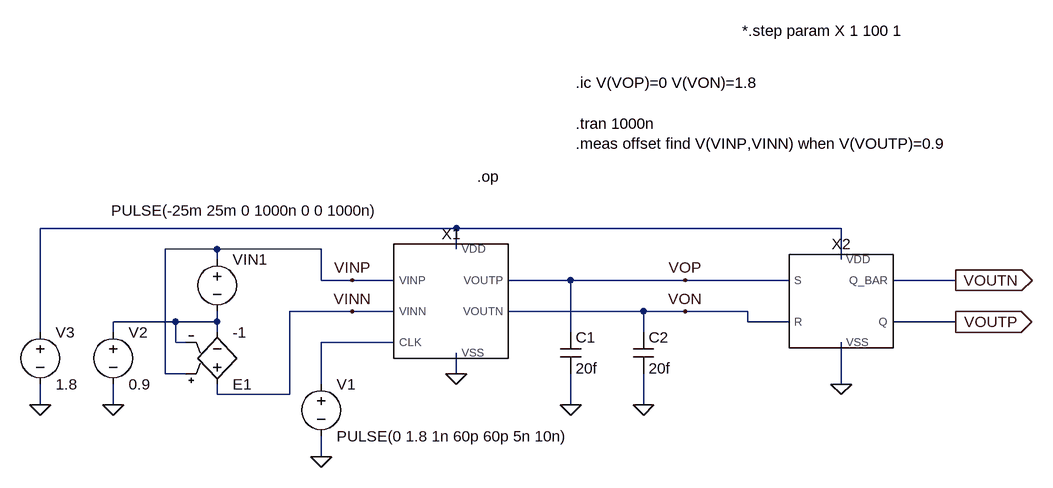
[diagram p0: schematic tb_offset.asc]
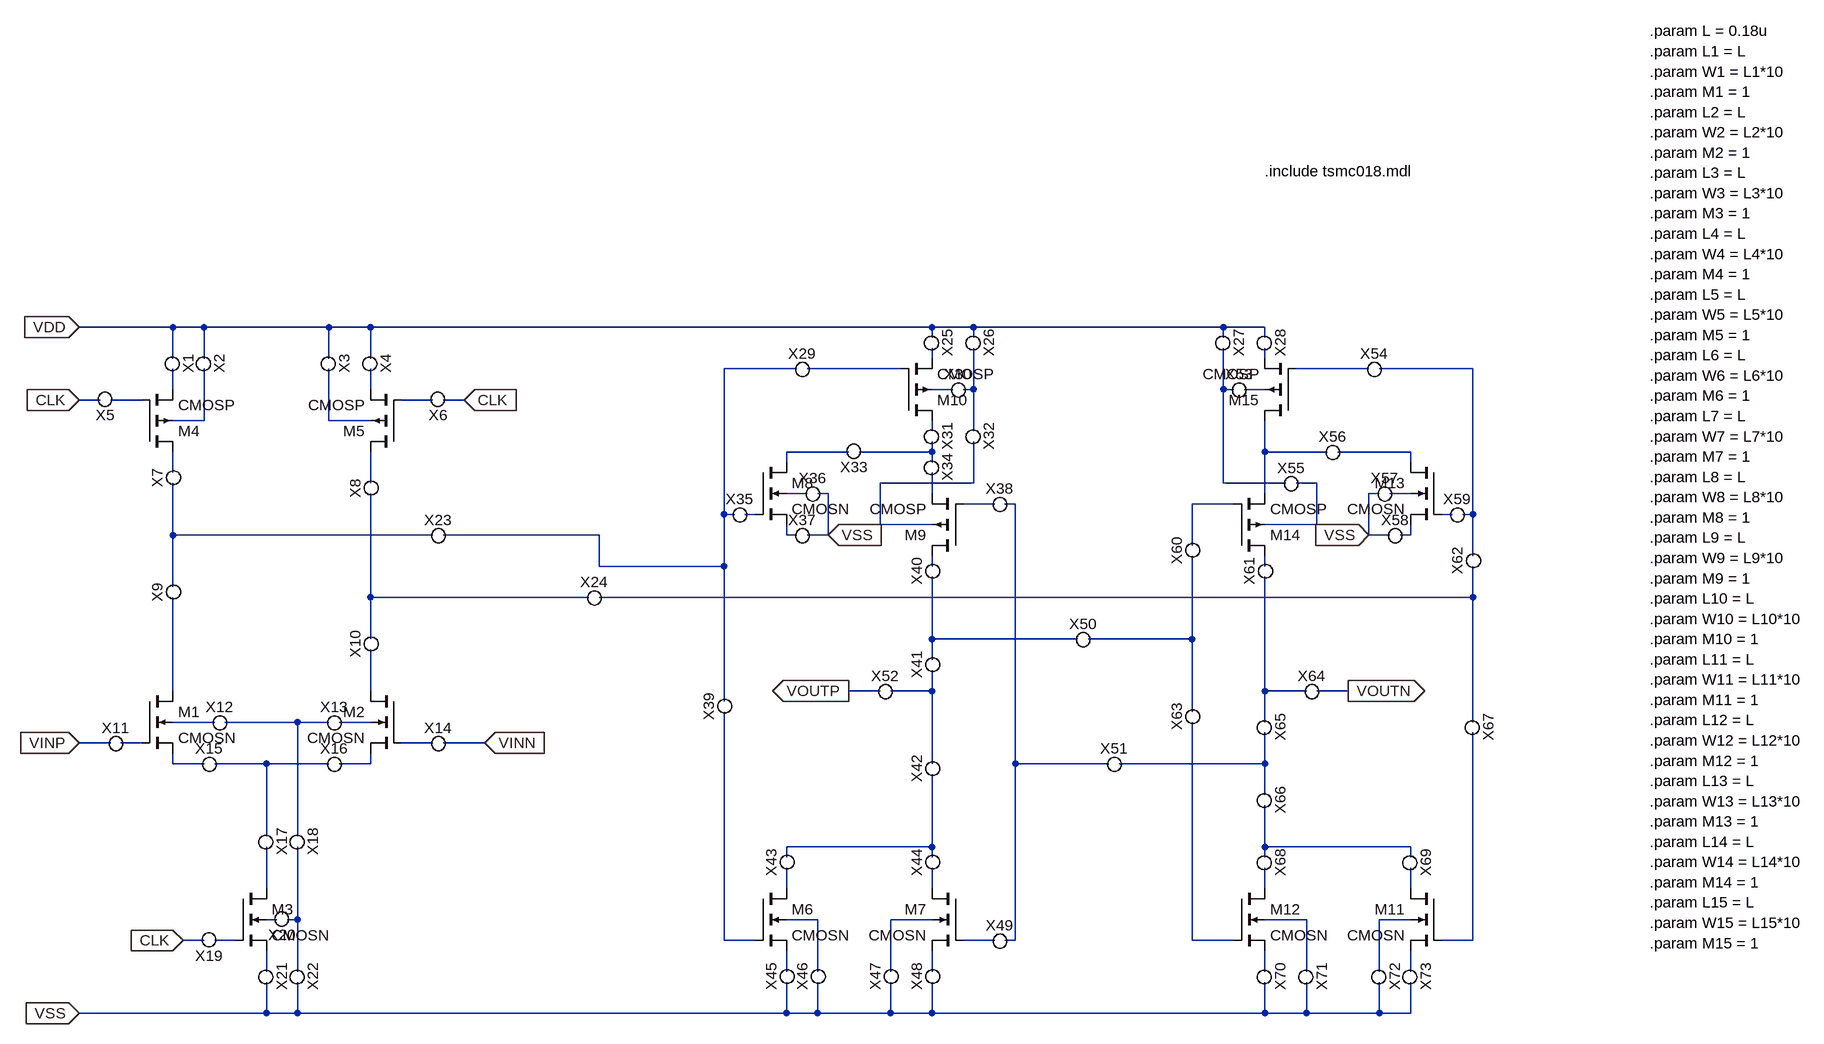
[diagram p1: sub-circuit my_comparator.asc]
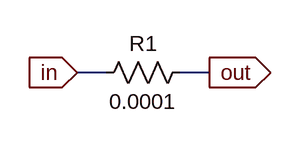
[diagram p2: sub-circuit para_register.asc]
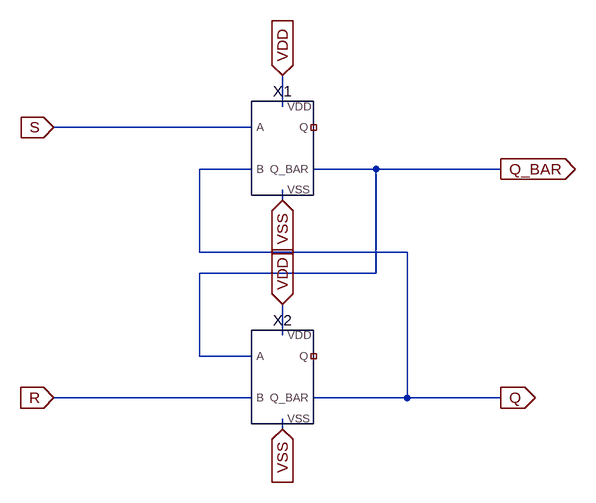
[diagram p3: sub-circuit my_sr_flipflop.asc]
tb_offset.asc, the LTspice schematic file:
Version 4
SHEET 1 904 680
WIRE -16 112 -656 112
WIRE 576 112 -16 112
WIRE -384 144 -464 144
WIRE -224 144 -384 144
WIRE -16 144 -16 112
WIRE -384 160 -384 144
WIRE 576 160 576 112
WIRE -224 192 -224 144
WIRE -176 192 -224 192
WIRE -112 192 -176 192
WIRE 160 192 64 192
WIRE 336 192 160 192
WIRE 496 192 336 192
WIRE 752 192 656 192
WIRE -176 240 -272 240
WIRE -112 240 -176 240
WIRE 272 240 64 240
WIRE 336 240 272 240
WIRE 432 240 336 240
WIRE -448 256 -544 256
WIRE -384 256 -384 240
WIRE -384 256 -448 256
WIRE 432 256 432 240
WIRE 496 256 432 256
WIRE 752 256 656 256
WIRE -656 272 -656 112
WIRE -544 272 -544 256
WIRE -384 272 -384 256
WIRE 160 272 160 192
WIRE 272 272 272 240
WIRE -448 288 -448 256
WIRE -432 288 -448 288
WIRE -112 288 -224 288
WIRE -464 336 -464 144
WIRE -432 336 -464 336
WIRE -16 336 -16 304
WIRE -224 352 -224 288
WIRE 576 352 576 288
WIRE -384 368 -384 352
WIRE -272 368 -272 240
WIRE -272 368 -384 368
WIRE -656 384 -656 352
WIRE -544 384 -544 352
WIRE 160 384 160 336
WIRE 272 384 272 336
WIRE -224 464 -224 432
FLAG -656 384 0
FLAG -544 384 0
FLAG -224 464 0
FLAG 160 384 0
FLAG 272 384 0
FLAG -16 336 0
FLAG -176 192 VINP
FLAG -176 240 VINN
FLAG 336 192 VOP
FLAG 336 240 VON
FLAG 576 352 0
FLAG 752 192 VOUTN
IOPIN 752 192 Out
FLAG 752 256 VOUTP
IOPIN 752 256 Out
SYMBOL voltage -224 336 R0
WINDOW 123 0 0 Left 0
WINDOW 39 0 0 Left 0
SYMATTR InstName V1
SYMATTR Value PULSE(0 1.8 1n 60p 60p 5n 10n)
SYMBOL voltage -384 144 R0
WINDOW 123 0 0 Left 0
WINDOW 39 0 0 Left 0
WINDOW 3 -163 -59 Left 2
SYMATTR Value PULSE(-25m 25m 0 1000n 0 0 1000n)
SYMATTR InstName VIN1
SYMBOL voltage -544 256 R0
WINDOW 123 0 0 Left 0
WINDOW 39 0 0 Left 0
SYMATTR InstName V2
SYMATTR Value 0.9
SYMBOL voltage -656 256 R0
WINDOW 123 0 0 Left 0
WINDOW 39 0 0 Left 0
SYMATTR InstName V3
SYMATTR Value 1.8
SYMBOL e -384 368 M180
SYMATTR InstName E1
SYMATTR Value -1
SYMBOL cap 144 272 R0
SYMATTR InstName C1
SYMATTR Value 20f
SYMBOL cap 256 272 R0
SYMATTR InstName C2
SYMATTR Value 20f
SYMBOL my_comparator -32 224 R0
SYMATTR InstName X1
SYMBOL my_sr_flipflop 576 224 R0
SYMATTR InstName X2
TEXT 16 32 Left 2 !.op
TEXT 168 -112 Left 2 !.ic V(VOP)=0 V(VON)=1.8\n \n.tran 1000n\n.meas offset find V(VINP,VINN) when V(VOUTP)=0.9
TEXT 424 -192 Left 2 !*.step param X 1 100 1

my_comparator.asc, the sub-circuit schematic file:
Version 4
SHEET 1 2728 992
WIRE 80 -400 -64 -400
WIRE 128 -400 80 -400
WIRE 320 -400 128 -400
WIRE 384 -400 320 -400
WIRE 1248 -400 384 -400
WIRE 1312 -400 1248 -400
WIRE 1696 -400 1312 -400
WIRE 1760 -400 1696 -400
WIRE 1248 -384 1248 -400
WIRE 1312 -384 1312 -400
WIRE 1696 -384 1696 -400
WIRE 1760 -384 1760 -400
WIRE 80 -352 80 -400
WIRE 128 -352 128 -400
WIRE 320 -352 320 -400
WIRE 384 -352 384 -400
WIRE 1248 -352 1248 -368
WIRE 1760 -352 1760 -368
WIRE 1040 -336 928 -336
WIRE 1200 -336 1056 -336
WIRE 1920 -336 1808 -336
WIRE 2080 -336 1936 -336
WIRE 80 -304 80 -336
WIRE 384 -304 384 -336
WIRE 1280 -304 1248 -304
WIRE 1312 -304 1312 -368
WIRE 1312 -304 1296 -304
WIRE 1696 -304 1696 -368
WIRE 1712 -304 1696 -304
WIRE 1760 -304 1728 -304
WIRE -32 -288 -64 -288
WIRE 32 -288 -16 -288
WIRE 480 -288 432 -288
WIRE 528 -288 496 -288
WIRE 128 -256 128 -336
WIRE 128 -256 80 -256
WIRE 320 -256 320 -336
WIRE 384 -256 320 -256
WIRE 1248 -240 1248 -256
WIRE 1312 -240 1312 -304
WIRE 1120 -208 1024 -208
WIRE 1248 -208 1248 -224
WIRE 1248 -208 1136 -208
WIRE 1760 -208 1760 -256
WIRE 1856 -208 1760 -208
WIRE 1984 -208 1872 -208
WIRE 1024 -192 1024 -208
WIRE 1248 -192 1248 -208
WIRE 1984 -192 1984 -208
WIRE 80 -176 80 -208
WIRE 384 -160 384 -208
WIRE 1312 -160 1312 -224
WIRE 1312 -160 1168 -160
WIRE 1696 -160 1696 -304
WIRE 1792 -160 1696 -160
WIRE 1840 -160 1808 -160
WIRE 1056 -144 1024 -144
WIRE 1088 -144 1072 -144
WIRE 1248 -144 1248 -176
WIRE 1760 -144 1760 -208
WIRE 1936 -144 1920 -144
WIRE 1984 -144 1952 -144
WIRE 1344 -128 1296 -128
WIRE 1376 -128 1360 -128
WIRE 1712 -128 1648 -128
WIRE 928 -112 928 -336
WIRE 944 -112 928 -112
WIRE 976 -112 960 -112
WIRE 2048 -112 2032 -112
WIRE 2080 -112 2080 -336
WIRE 2080 -112 2064 -112
WIRE 1168 -96 1168 -160
WIRE 1248 -96 1168 -96
WIRE 1840 -96 1840 -160
WIRE 1840 -96 1760 -96
WIRE 80 -80 80 -160
WIRE 480 -80 80 -80
WIRE 736 -80 496 -80
WIRE 1024 -80 1024 -96
WIRE 1040 -80 1024 -80
WIRE 1088 -80 1088 -144
WIRE 1088 -80 1056 -80
WIRE 1920 -80 1920 -144
WIRE 1952 -80 1920 -80
WIRE 1984 -80 1984 -96
WIRE 1984 -80 1968 -80
WIRE 1648 -64 1648 -128
WIRE 2080 -48 2080 -112
WIRE 736 -32 736 -80
WIRE 928 -32 928 -112
WIRE 928 -32 736 -32
WIRE 1248 -32 1248 -48
WIRE 1760 -32 1760 -48
WIRE 80 0 80 -80
WIRE 384 16 384 -144
WIRE 720 16 384 16
WIRE 2080 16 2080 -32
WIRE 2080 16 736 16
WIRE 384 80 384 16
WIRE 1248 80 1248 -16
WIRE 1472 80 1248 80
WIRE 1648 80 1648 -48
WIRE 1648 80 1488 80
WIRE 1248 112 1248 80
WIRE 80 160 80 16
WIRE 384 160 384 96
WIRE 1168 160 1120 160
WIRE 1248 160 1248 128
WIRE 1248 160 1184 160
WIRE 1760 160 1760 -16
WIRE 1824 160 1760 160
WIRE 1888 160 1840 160
WIRE 928 176 928 -32
WIRE 1648 192 1648 80
WIRE 144 208 80 208
WIRE 272 208 160 208
WIRE 320 208 272 208
WIRE 384 208 336 208
WIRE 1760 208 1760 160
WIRE 2080 208 2080 16
WIRE -16 240 -64 240
WIRE 32 240 0 240
WIRE 480 240 432 240
WIRE 560 240 496 240
WIRE 80 272 80 256
WIRE 128 272 80 272
WIRE 224 272 144 272
WIRE 320 272 224 272
WIRE 384 272 384 256
WIRE 384 272 336 272
WIRE 1248 272 1248 160
WIRE 1376 272 1376 -128
WIRE 1520 272 1376 272
WIRE 1760 272 1760 224
WIRE 1760 272 1536 272
WIRE 1760 320 1760 272
WIRE 224 384 224 272
WIRE 272 384 272 208
WIRE 1248 400 1248 288
WIRE 1248 400 1024 400
WIRE 1760 400 1760 336
WIRE 1984 400 1760 400
WIRE 1024 416 1024 400
WIRE 1248 416 1248 400
WIRE 1760 416 1760 400
WIRE 1984 416 1984 400
WIRE 224 464 224 400
WIRE 1024 464 1024 432
WIRE 1248 464 1248 432
WIRE 1760 464 1760 432
WIRE 1984 464 1984 432
WIRE 240 512 224 512
WIRE 272 512 272 400
WIRE 272 512 256 512
WIRE 1072 512 1024 512
WIRE 1248 512 1184 512
WIRE 1824 512 1760 512
WIRE 1984 512 1936 512
WIRE 128 544 96 544
WIRE 176 544 144 544
WIRE 928 544 928 192
WIRE 976 544 928 544
WIRE 1344 544 1296 544
WIRE 1376 544 1376 272
WIRE 1376 544 1360 544
WIRE 1648 544 1648 208
WIRE 1712 544 1648 544
WIRE 2080 544 2080 224
WIRE 2080 544 2032 544
WIRE 224 592 224 560
WIRE 272 592 272 512
WIRE 1024 592 1024 560
WIRE 1072 592 1072 512
WIRE 1184 592 1184 512
WIRE 1248 592 1248 560
WIRE 1760 592 1760 560
WIRE 1824 592 1824 512
WIRE 1936 592 1936 512
WIRE 1984 592 1984 560
WIRE 224 656 224 608
WIRE 224 656 -64 656
WIRE 272 656 272 608
WIRE 272 656 224 656
WIRE 1024 656 1024 608
WIRE 1024 656 272 656
WIRE 1072 656 1072 608
WIRE 1072 656 1024 656
WIRE 1184 656 1184 608
WIRE 1184 656 1072 656
WIRE 1248 656 1248 608
WIRE 1248 656 1184 656
WIRE 1760 656 1760 608
WIRE 1760 656 1248 656
WIRE 1824 656 1824 608
WIRE 1824 656 1760 656
WIRE 1936 656 1936 608
WIRE 1936 656 1824 656
WIRE 1984 656 1984 608
WIRE 1984 656 1936 656
FLAG -64 -400 VDD
IOPIN -64 -400 In
FLAG -64 -288 CLK
IOPIN -64 -288 In
FLAG -64 240 VINP
IOPIN -64 240 In
FLAG -64 656 VSS
IOPIN -64 656 In
FLAG 560 240 VINN
IOPIN 560 240 In
FLAG 96 544 CLK
IOPIN 96 544 In
FLAG 528 -288 CLK
IOPIN 528 -288 In
FLAG 1088 -80 VSS
IOPIN 1088 -80 In
FLAG 1120 160 VOUTP
IOPIN 1120 160 Out
FLAG 1920 -80 VSS
IOPIN 1920 -80 In
FLAG 1888 160 VOUTN
IOPIN 1888 160 Out
SYMBOL nmos4 432 160 M0
SYMATTR InstName M2
SYMATTR Value CMOSN
SYMATTR Value2 l={L2} w={W2} m={M2}
SYMBOL nmos4 176 464 R0
SYMATTR InstName M3
SYMATTR Value CMOSN
SYMATTR Value2 l={L3} w={W3} m={M3}
SYMBOL pmos4 32 -208 M180
SYMATTR InstName M4
SYMATTR Value CMOSP
SYMATTR Value2 l={L4} w={W4} m={M4}
SYMBOL pmos4 432 -208 R180
SYMATTR InstName M5
SYMATTR Value CMOSP
SYMATTR Value2 l={L5} w={W5} m={M5}
SYMBOL nmos4 32 160 R0
SYMATTR InstName M1
SYMATTR Value CMOSN
SYMATTR Value2 l={L1} w={W1} m={M1}
SYMBOL nmos4 976 464 R0
SYMATTR InstName M6
SYMATTR Value CMOSN
SYMATTR Value2 l={L6} w={W6} m={M6}
SYMBOL nmos4 1296 464 M0
SYMATTR InstName M7
SYMATTR Value CMOSN
SYMATTR Value2 l={L7} w={W7} m={M7}
SYMBOL nmos4 976 -192 R0
SYMATTR InstName M8
SYMATTR Value CMOSN
SYMATTR Value2 l={L8} w={W8} m={M8}
SYMBOL pmos4 1296 -48 R180
SYMATTR InstName M9
SYMATTR Value CMOSP
SYMATTR Value2 l={L9} w={W9} m={M9}
SYMBOL pmos4 1200 -256 M180
SYMATTR InstName M10
SYMATTR Value CMOSP
SYMATTR Value2 l={L10} w={W10} m={M10}
SYMBOL nmos4 2032 464 M0
SYMATTR InstName M11
SYMATTR Value CMOSN
SYMATTR Value2 l={L11} w={W11} m={M11}
SYMBOL nmos4 1712 464 R0
SYMATTR InstName M12
SYMATTR Value CMOSN
SYMATTR Value2 l={L12} w={W12} m={M12}
SYMBOL nmos4 2032 -192 M0
SYMATTR InstName M13
SYMATTR Value CMOSN
SYMATTR Value2 l={L13} w={W13} m={M13}
SYMBOL pmos4 1712 -48 M180
SYMATTR InstName M14
SYMATTR Value CMOSP
SYMATTR Value2 l={L14} w={W14} m={M14}
SYMBOL pmos4 1808 -256 R180
SYMATTR InstName M15
SYMATTR Value CMOSP
SYMATTR Value2 l={L15} w={W15} m={M15}
SYMBOL para_register 64 -352 R90
SYMATTR InstName X1
SYMBOL para_register 112 -352 R90
SYMATTR InstName X2
SYMBOL para_register 304 -352 R90
SYMATTR InstName X3
SYMBOL para_register 368 -352 R90
SYMATTR InstName X4
SYMBOL para_register -16 -304 R180
SYMATTR InstName X5
SYMBOL para_register 496 -304 R180
SYMATTR InstName X6
SYMBOL para_register 96 -160 R270
SYMATTR InstName X7
SYMBOL para_register 400 -144 R270
SYMATTR InstName X8
SYMBOL para_register 96 16 R270
SYMATTR InstName X9
SYMBOL para_register 400 96 R270
SYMATTR InstName X10
SYMBOL para_register -16 256 R0
SYMATTR InstName X11
SYMBOL para_register 144 224 R0
SYMATTR InstName X12
SYMBOL para_register 320 224 R0
SYMATTR InstName X13
SYMBOL para_register 480 256 R0
SYMATTR InstName X14
SYMBOL para_register 128 288 R0
SYMATTR InstName X15
SYMBOL para_register 320 288 R0
SYMATTR InstName X16
SYMBOL para_register 208 384 R90
SYMATTR InstName X17
SYMBOL para_register 256 384 R90
SYMATTR InstName X18
SYMBOL para_register 144 528 R180
SYMATTR InstName X19
SYMBOL para_register 256 496 R180
SYMATTR InstName X20
SYMBOL para_register 208 592 R90
SYMATTR InstName X21
SYMBOL para_register 256 592 R90
SYMATTR InstName X22
SYMBOL para_register 480 -64 R0
SYMATTR InstName X23
SYMBOL para_register 720 32 R0
SYMATTR InstName X24
SYMBOL para_register 1232 -384 R90
SYMATTR InstName X25
SYMBOL para_register 1296 -384 R90
SYMATTR InstName X26
SYMBOL para_register 1680 -384 R90
SYMATTR InstName X27
SYMBOL para_register 1744 -384 R90
SYMATTR InstName X28
SYMBOL para_register 1040 -320 R0
SYMATTR InstName X29
SYMBOL para_register 1280 -288 R0
SYMATTR InstName X30
SYMBOL para_register 1232 -240 R90
SYMATTR InstName X31
SYMBOL para_register 1296 -240 R90
SYMATTR InstName X32
SYMBOL para_register 1136 -224 R180
SYMATTR InstName X33
SYMBOL para_register 1232 -192 R90
SYMATTR InstName X34
SYMBOL para_register 944 -96 R0
SYMATTR InstName X35
SYMBOL para_register 1056 -128 R0
SYMATTR InstName X36
SYMBOL para_register 1040 -64 R0
SYMATTR InstName X37
SYMBOL para_register 1344 -112 R0
SYMATTR InstName X38
SYMBOL para_register 944 192 R270
SYMATTR InstName X39
SYMBOL para_register 1264 -16 R270
SYMATTR InstName X40
SYMBOL para_register 1264 128 R270
SYMATTR InstName X41
SYMBOL para_register 1264 288 R270
SYMATTR InstName X42
SYMBOL para_register 1040 432 R270
SYMATTR InstName X43
SYMBOL para_register 1264 432 R270
SYMATTR InstName X44
SYMBOL para_register 1040 608 R270
SYMATTR InstName X45
SYMBOL para_register 1088 608 R270
SYMATTR InstName X46
SYMBOL para_register 1200 608 R270
SYMATTR InstName X47
SYMBOL para_register 1264 608 R270
SYMATTR InstName X48
SYMBOL para_register 1344 560 R0
SYMATTR InstName X49
SYMBOL para_register 1472 96 R0
SYMATTR InstName X50
SYMBOL para_register 1520 288 R0
SYMATTR InstName X51
SYMBOL para_register 1168 176 R0
SYMATTR InstName X52
SYMBOL para_register 1712 -288 R0
SYMATTR InstName X53
SYMBOL para_register 1920 -320 R0
SYMATTR InstName X54
SYMBOL para_register 1792 -144 R0
SYMATTR InstName X55
SYMBOL para_register 1856 -192 R0
SYMATTR InstName X56
SYMBOL para_register 1936 -128 R0
SYMATTR InstName X57
SYMBOL para_register 1952 -64 R0
SYMATTR InstName X58
SYMBOL para_register 2048 -96 R0
SYMATTR InstName X59
SYMBOL para_register 1664 -48 R270
SYMATTR InstName X60
SYMBOL para_register 1776 -16 R270
SYMATTR InstName X61
SYMBOL para_register 2096 -32 R270
SYMATTR InstName X62
SYMBOL para_register 1664 208 R270
SYMATTR InstName X63
SYMBOL para_register 1824 176 R0
SYMATTR InstName X64
SYMBOL para_register 1744 208 R90
SYMATTR InstName X65
SYMBOL para_register 1744 320 R90
SYMATTR InstName X66
SYMBOL para_register 2064 208 R90
SYMATTR InstName X67
SYMBOL para_register 1744 416 R90
SYMATTR InstName X68
SYMBOL para_register 1968 416 R90
SYMATTR InstName X69
SYMBOL para_register 1744 592 R90
SYMATTR InstName X70
SYMBOL para_register 1808 592 R90
SYMATTR InstName X71
SYMBOL para_register 1920 592 R90
SYMATTR InstName X72
SYMBOL para_register 1968 592 R90
SYMATTR InstName X73
TEXT 2352 -856 Left 2 !.param L = 0.18u\n.param L1 = L\n.param W1 = L1*10\n.param M1 = 1\n.param L2 = L\n.param W2 = L2*10\n.param M2 = 1\n.param L3 = L\n.param W3 = L3*10\n.param M3 = 1\n.param L4 = L\n.param W4 = L4*10\n.param M4 = 1\n.param L5 = L\n.param W5 = L5*10\n.param M5 = 1\n.param L6 = L\n.param W6 = L6*10\n.param M6 = 1\n.param L7 = L\n.param W7 = L7*10\n.param M7 = 1\n.param L8 = L\n.param W8 = L8*10\n.param M8 = 1\n.param L9 = L\n.param W9 = L9*10\n.param M9 = 1\n.param L10 = L\n.param W10 = L10*10\n.param M10 = 1\n.param L11 = L\n.param W11 = L11*10\n.param M11 = 1\n.param L12 = L\n.param W12 = L12*10\n.param M12 = 1\n.param L13 = L\n.param W13 = L13*10\n.param M13 = 1\n.param L14 = L\n.param W14 = L14*10\n.param M14 = 1\n.param L15 = L\n.param W15 = L15*10\n.param M15 = 1
TEXT 1760 -640 Left 2 !.include tsmc018.mdl

para_register.asc, the sub-circuit schematic file:
Version 4
SHEET 1 880 680
WIRE 160 -176 128 -176
WIRE 272 -176 240 -176
FLAG 128 -176 in
IOPIN 128 -176 In
FLAG 272 -176 out
IOPIN 272 -176 Out
SYMBOL res 256 -192 R90
WINDOW 0 0 56 VBottom 2
WINDOW 3 32 56 VTop 2
SYMATTR InstName R1
SYMATTR Value 0.0001

my_sr_flipflop.asc, the sub-circuit schematic file:
Version 4
SHEET 1 1048 700
WIRE 224 112 224 64
WIRE 176 144 -128 144
WIRE 176 208 96 208
WIRE 368 208 272 208
WIRE 560 208 368 208
WIRE 224 256 224 240
WIRE 96 336 96 208
WIRE 416 336 96 336
WIRE 368 368 368 208
WIRE 368 368 96 368
WIRE 224 464 224 416
WIRE 96 496 96 368
WIRE 176 496 96 496
WIRE 176 560 -128 560
WIRE 416 560 416 336
WIRE 416 560 272 560
WIRE 560 560 416 560
WIRE 224 608 224 592
FLAG 224 64 VDD
IOPIN 224 64 In
FLAG 224 416 VDD
IOPIN 224 416 In
FLAG -128 144 S
IOPIN -128 144 In
FLAG -128 560 R
IOPIN -128 560 In
FLAG 560 208 Q_BAR
IOPIN 560 208 Out
FLAG 560 560 Q
IOPIN 560 560 Out
FLAG 224 256 VSS
IOPIN 224 256 In
FLAG 224 608 VSS
IOPIN 224 608 In
SYMBOL my_cmos_or 224 176 R0
SYMATTR InstName X1
SYMBOL my_cmos_or 224 528 R0
SYMATTR InstName X2

The netlist it stands for:
* tb_offset.asc
V1 N003 0 PULSE(0 1.8 1n 60p 60p 5n 10n)
VIN1 VINP N002 PULSE(-25m 25m 0 1000n 0 0 1000n)
V2 N002 0 0.9
V3 N001 0 1.8
E1 VINN N002 VINP N002 -1
C1 VOP 0 20f
C2 VON 0 20f
XX1 N003 N001 VINN VINP 0 VON VOP my_comparator
XX2 VON VOP N001 0 VOUTP VOUTN my_sr_flipflop

* block symbol definitions
.subckt my_comparator CLK VDD VINN VINP VSS VOUTN VOUTP
M2 N044 N051 N054 N049 CMOSN l={L2} w={W2} m={M2}
M3 N058 N069 N074 N063 CMOSN l={L3} w={W3} m={M3}
M4 N022 N013 N007 N015 CMOSP l={L4} w={W4} m={M4}
M5 N023 N014 N008 N016 CMOSP l={L5} w={W5} m={M5}
M1 N043 N050 N052 N047 CMOSN l={L1} w={W1} m={M1}
M6 N059 N070 N075 N065 CMOSN l={L6} w={W6} m={M6}
M7 N060 N071 N076 N066 CMOSN l={L7} w={W7} m={M7}
M8 N018 N032 N035 N026 CMOSN l={L8} w={W8} m={M8}
M9 N037 N029 N027 N024 CMOSP l={L9} w={W9} m={M9}
M10 N017 N004 N001 N009 CMOSP l={L10} w={W10} m={M10}
M11 N062 N073 N078 N068 CMOSN l={L11} w={W11} m={M11}
M12 N061 N072 N077 N067 CMOSN l={L12} w={W12} m={M12}
M13 N021 N033 N036 N028 CMOSN l={L13} w={W13} m={M13}
M14 N038 N031 N020 N025 CMOSP l={L14} w={W14} m={M14}
M15 N020 N005 N002 N012 CMOSP l={L15} w={W15} m={M15}
XX1 VDD N007 para_register
XX2 VDD N015 para_register
XX3 VDD N016 para_register
XX4 VDD N008 para_register
XX5 N013 CLK para_register
XX6 CLK N014 para_register
XX7 N034 N022 para_register
XX8 N039 N023 para_register
XX9 N043 N034 para_register
XX10 N044 N039 para_register
XX11 VINP N050 para_register
XX12 N047 N048 para_register
XX13 N048 N049 para_register
XX14 N051 VINN para_register
XX15 N052 N053 para_register
XX16 N053 N054 para_register
XX17 N053 N058 para_register
XX18 N048 N064 para_register
XX19 N069 CLK para_register
XX20 N064 N063 para_register
XX21 N074 VSS para_register
XX22 N064 VSS para_register
XX23 N034 N003 para_register
XX24 N039 N040 para_register
XX25 VDD N001 para_register
XX26 VDD N010 para_register
XX27 VDD N011 para_register
XX28 VDD N002 para_register
XX29 N003 N004 para_register
XX30 N009 N010 para_register
XX31 N017 N019 para_register
XX32 N010 N024 para_register
XX33 N019 N018 para_register
XX34 N019 N027 para_register
XX35 N003 N032 para_register
XX36 N026 VSS para_register
XX37 N035 VSS para_register
XX38 N029 N030 para_register
XX39 N070 N003 para_register
XX40 N041 N037 para_register
XX41 N045 N041 para_register
XX42 N056 N045 para_register
XX43 N059 N056 para_register
XX44 N060 N056 para_register
XX45 VSS N075 para_register
XX46 VSS N065 para_register
XX47 VSS N066 para_register
XX48 VSS N076 para_register
XX49 N071 N030 para_register
XX50 N041 N042 para_register
XX51 N030 N055 para_register
XX52 VOUTP N045 para_register
XX53 N011 N012 para_register
XX54 N005 N006 para_register
XX55 N011 N025 para_register
XX56 N020 N021 para_register
XX57 VSS N028 para_register
XX58 VSS N036 para_register
XX59 N033 N006 para_register
XX60 N042 N031 para_register
XX61 N046 N038 para_register
XX62 N040 N006 para_register
XX63 N072 N042 para_register
XX64 N046 VOUTN para_register
XX65 N046 N055 para_register
XX66 N055 N057 para_register
XX67 N040 N073 para_register
XX68 N057 N061 para_register
XX69 N057 N062 para_register
XX70 N077 VSS para_register
XX71 N067 VSS para_register
XX72 N068 VSS para_register
XX73 N078 VSS para_register
.param L = 0.18u
.param L1 = L
.param W1 = L1*10
.param M1 = 1
.param L2 = L
.param W2 = L2*10
.param M2 = 1
.param L3 = L
.param W3 = L3*10
.param M3 = 1
.param L4 = L
.param W4 = L4*10
.param M4 = 1
.param L5 = L
.param W5 = L5*10
.param M5 = 1
.param L6 = L
.param W6 = L6*10
.param M6 = 1
.param L7 = L
.param W7 = L7*10
.param M7 = 1
.param L8 = L
.param W8 = L8*10
.param M8 = 1
.param L9 = L
.param W9 = L9*10
.param M9 = 1
.param L10 = L
.param W10 = L10*10
.param M10 = 1
.param L11 = L
.param W11 = L11*10
.param M11 = 1
.param L12 = L
.param W12 = L12*10
.param M12 = 1
.param L13 = L
.param W13 = L13*10
.param M13 = 1
.param L14 = L
.param W14 = L14*10
.param M14 = 1
.param L15 = L
.param W15 = L15*10
.param M15 = 1
.include tsmc018.mdl
.ends my_comparator

.subckt para_register in out
R1 out in 0.0001
.ends para_register

.subckt my_sr_flipflop R S VDD VSS Q Q_BAR
XX1 S Q VDD VSS NC_01 Q_BAR my_cmos_or  ; pins A B VDD VSS Q Q_BAR
XX2 Q_BAR R VDD VSS NC_02 Q my_cmos_or  ; pins A B VDD VSS Q Q_BAR
.ends my_sr_flipflop

.model NMOS NMOS
.model PMOS PMOS
.lib standard.mos
.op
.ic V(VOP)=0 V(VON)=1.8
.tran 1000n
.meas offset find V(VINP,VINN) when V(VOUTP)=0.9
*.step param X 1 100 1
.backanno
.end